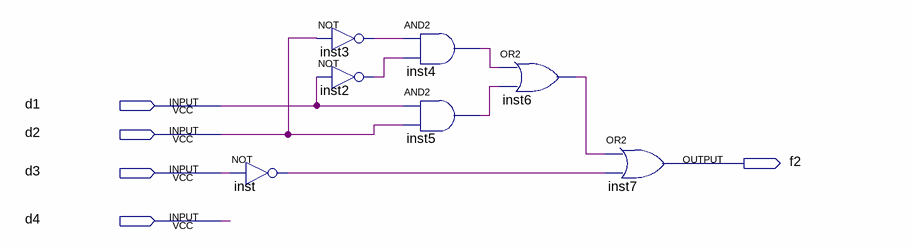
[diagram p0: schematic sheet]
// Quartus schematic f2_segment.bdf as structural Verilog: 7 symbols, 5 pins
module f2_segment (
  input  d1,
  input  d2,
  input  d3,
  input  d4,
  output f2
);

  wire inst2_out, inst3_out, inst4_out, inst5_out, inst6_out, inst_out;

  not inst (inst_out, d3);
  not inst3 (inst3_out, d2);
  not inst2 (inst2_out, d1);
  and inst4 (inst4_out, inst3_out, inst2_out);
  and inst5 (inst5_out, d1, d2);
  or inst6 (inst6_out, inst4_out, inst5_out);
  or inst7 (f2, inst6_out, inst_out);
endmodule
